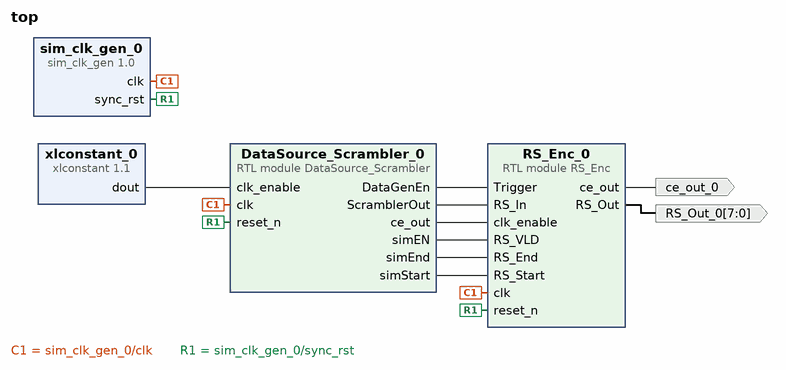
[diagram p0: block diagram of the top level]
# Vivado block design top, xc7k325tffg900-2, Vivado 2023.2
create_bd_design top

create_bd_port -dir O -from 7 -to 0 RS_Out_0
create_bd_port -dir O ce_out_0

create_bd_cell -type module -reference DataSource_Scrambler DataSource_Scrambler_0
create_bd_cell -type ip -vlnv xilinx.com:ip:sim_clk_gen:1.0 sim_clk_gen_0
set_property -dict {CONFIG.FREQ_HZ 200000000} [get_bd_cells sim_clk_gen_0]
create_bd_cell -type ip -vlnv xilinx.com:ip:xlconstant:1.1 xlconstant_0
create_bd_cell -type module -reference RS_Enc RS_Enc_0

# ---- connections ----

connect_bd_net [get_bd_pins DataSource_Scrambler_0/DataGenEn] [get_bd_pins RS_Enc_0/Trigger]
connect_bd_net [get_bd_pins DataSource_Scrambler_0/ScramblerOut] [get_bd_pins RS_Enc_0/RS_In]
connect_bd_net [get_bd_pins DataSource_Scrambler_0/ce_out] [get_bd_pins RS_Enc_0/clk_enable]
connect_bd_net [get_bd_pins DataSource_Scrambler_0/simEN] [get_bd_pins RS_Enc_0/RS_VLD]
connect_bd_net [get_bd_pins DataSource_Scrambler_0/simEnd] [get_bd_pins RS_Enc_0/RS_End]
connect_bd_net [get_bd_pins DataSource_Scrambler_0/simStart] [get_bd_pins RS_Enc_0/RS_Start]
connect_bd_net [get_bd_pins RS_Enc_0/RS_Out] [get_bd_ports RS_Out_0]
connect_bd_net [get_bd_pins RS_Enc_0/ce_out] [get_bd_ports ce_out_0]
connect_bd_net [get_bd_pins sim_clk_gen_0/clk] [get_bd_pins RS_Enc_0/clk] [get_bd_pins DataSource_Scrambler_0/clk]
connect_bd_net [get_bd_pins sim_clk_gen_0/sync_rst] [get_bd_pins RS_Enc_0/reset_n] [get_bd_pins DataSource_Scrambler_0/reset_n]
connect_bd_net [get_bd_pins xlconstant_0/dout] [get_bd_pins DataSource_Scrambler_0/clk_enable]

validate_bd_design
save_bd_design
